# EAGLE design D1 - LCD TH Dupont (EAGLE 9.5.2)
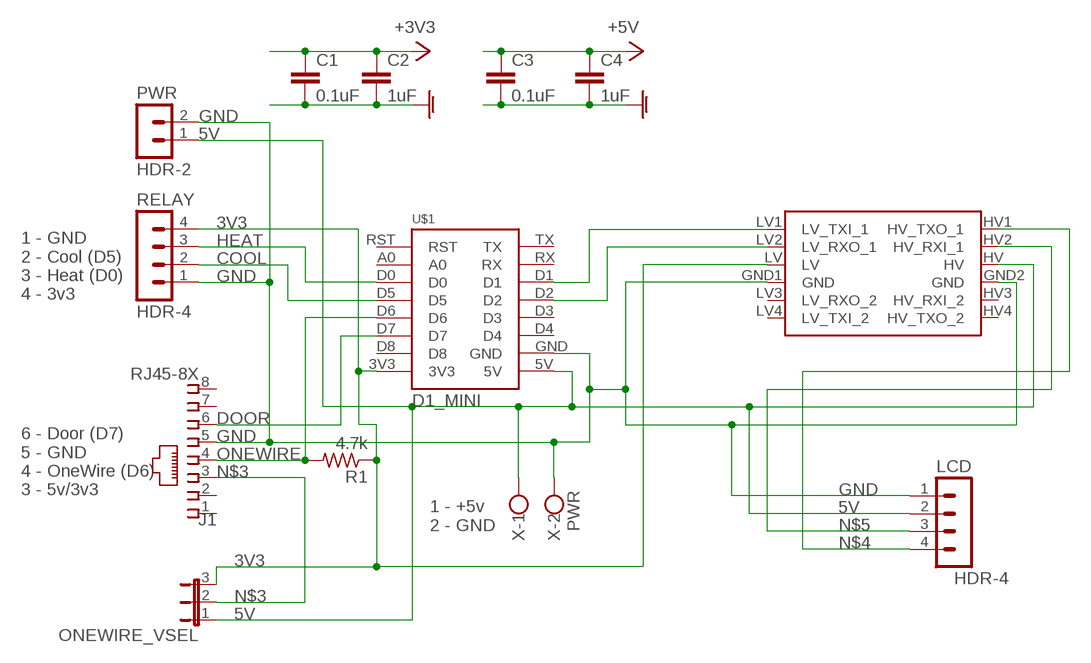
[diagram p0: schematic, sheet 1]

## Parts
C1  0.1uF  C-EU050-035X075  [C050-035X075]
C2  1uF  C-EU050-035X075  [C050-035X075]
C3  0.1uF  C-EU050-035X075  [C050-035X075]
C4  1uF  C-EU050-035X075  [C050-035X075]
J1  RJ45-8X  [RJ45-NS-XDIM]
LCD  HDR-4  [HDR-4_VERT]
ONEWIRE_VSEL  JP2ENOLABEL  [JP2-NOLABEL]
PWR  HDR-2  [HDR-2_VERT]
R1  4.7k  R-US_0309/12  [0309/12]
RELAY  HDR-4  [HDR-4_VERT]
U$1  D1_MINI  WEMOSCLEAN  [WEMOS-CLEAN]
U$3  SPARKFUN_LOGIC_LEVEL_CONVERTER  [SPARKFUN_LOGIC_LEVEL_CONVERTER]
X  PWR  W237-102  [W237-102]

## Nets
3V3 [3v]: C1.1 C2.1 ONEWIRE_VSEL.3 R1.1 RELAY.4 U$1.3V3 U$3.LV ; supply symbol labelled +3V3
5V [5v]: C3.1 C4.1 LCD.2 ONEWIRE_VSEL.1 PWR.1 U$1.5V U$3.HV X.1 ; supply symbol labelled +5V
COOL: RELAY.2 U$1.D5
DOOR: J1.6 U$1.D7
GND [Gnd]: C1.2 C2.2 C3.2 C4.2 J1.5 LCD.1 PWR.2 RELAY.1 U$1.GND U$3.GND1(GND) U$3.GND2(GND) X.2 ; supply symbol labelled GNDA
HEAT: RELAY.3 U$1.D0
N$1: U$1.D1 U$3.LV1(LV_TXI_1)
N$2: U$1.D2 U$3.LV2(LV_RXO_1)
N$3: J1.3 ONEWIRE_VSEL.2
N$4: LCD.4 U$3.HV1(HV_TXO_1)
N$5: LCD.3 U$3.HV2(HV_RXI_1)
ONEWIRE: J1.4 R1.2 U$1.D6
Unconnected: J1.1 J1.2 J1.7 J1.8 U$1.A0 U$1.D3 U$1.D4 U$1.D8 U$1.RST U$1.RX U$1.TX U$3.HV3(HV_RXI_2) U$3.HV4(HV_TXO_2) U$3.LV3(LV_RXO_2) U$3.LV4(LV_TXI_2)

## Notes on the sheet
- 1 - GND
  2 - Cool (D5)
  3 - Heat (D0)
  4 - 3v3
- 6 - Door (D7)
  5 - GND
  4 - OneWire (D6) 
  3 - 5v/3v3
- 1 - +5v
  2 - GND

## Library data of the parts
C1-C4 = rcl:C-EU: CAPACITOR, European symbol; SPICEPREFIX: C
J1 = Donnie:RJ45: CORCOM Modular RJ Jacks No Shield Source: www.tycoelectronics.com .. ENG_DS_1654001_1099_RJ_L_0507.pdf; MPN: RJ45-8X; OC_FARNELL: unknown; OC_NEWARK: 16R6101
LCD RELAY = Donnie:HDR-4: PIN HEADER
ONEWIRE_VSEL = Donnie:JP2E: JUMPER
PWR = Donnie:HDR-2
R1 = rcl:R-US_: RESISTOR, American symbol; SPICEPREFIX: R
U$1 = 1455413453956-wemos:WEMOS: LoLin D1 Mini controller socket
U$3 = SparkFun-Boards:SPARKFUN_LOGIC_LEVEL_CONVERTER: SparkFun Logic Level Converter -Bi-Directional This is the mechnical outline for the 3.3V - 5V bi directional logic level converter. *Note, the "LOCK" Package has the header pins staggered by an offset of 5 mils (off center line), so that when you slide a row of standard 0.1" headers into the PTH pads, it will hold position vertically. See the follwing turorial for more information on this type of special footprints: Sneaky Footprints <https://www.sparkfun.com/tutorials/114> SparkFun Products: SparkFun Logic Level Converter - Bi-Directional <https://www.sparkfun.com/products/12009>
X = con-wago-500:W237-102: WAGO SCREW CLAMP; MPN: 237-102; OC_FARNELL: unknown; OC_NEWARK: 70K9898

## Net classes
0 default: width 0.305 mm, clearance 0.305 mm
1 5v: width 0.406 mm, clearance 0.406 mm
2 3v: width 0.406 mm, clearance 0.406 mm
3 Gnd: width 0.406 mm, clearance 0.406 mm

## Board
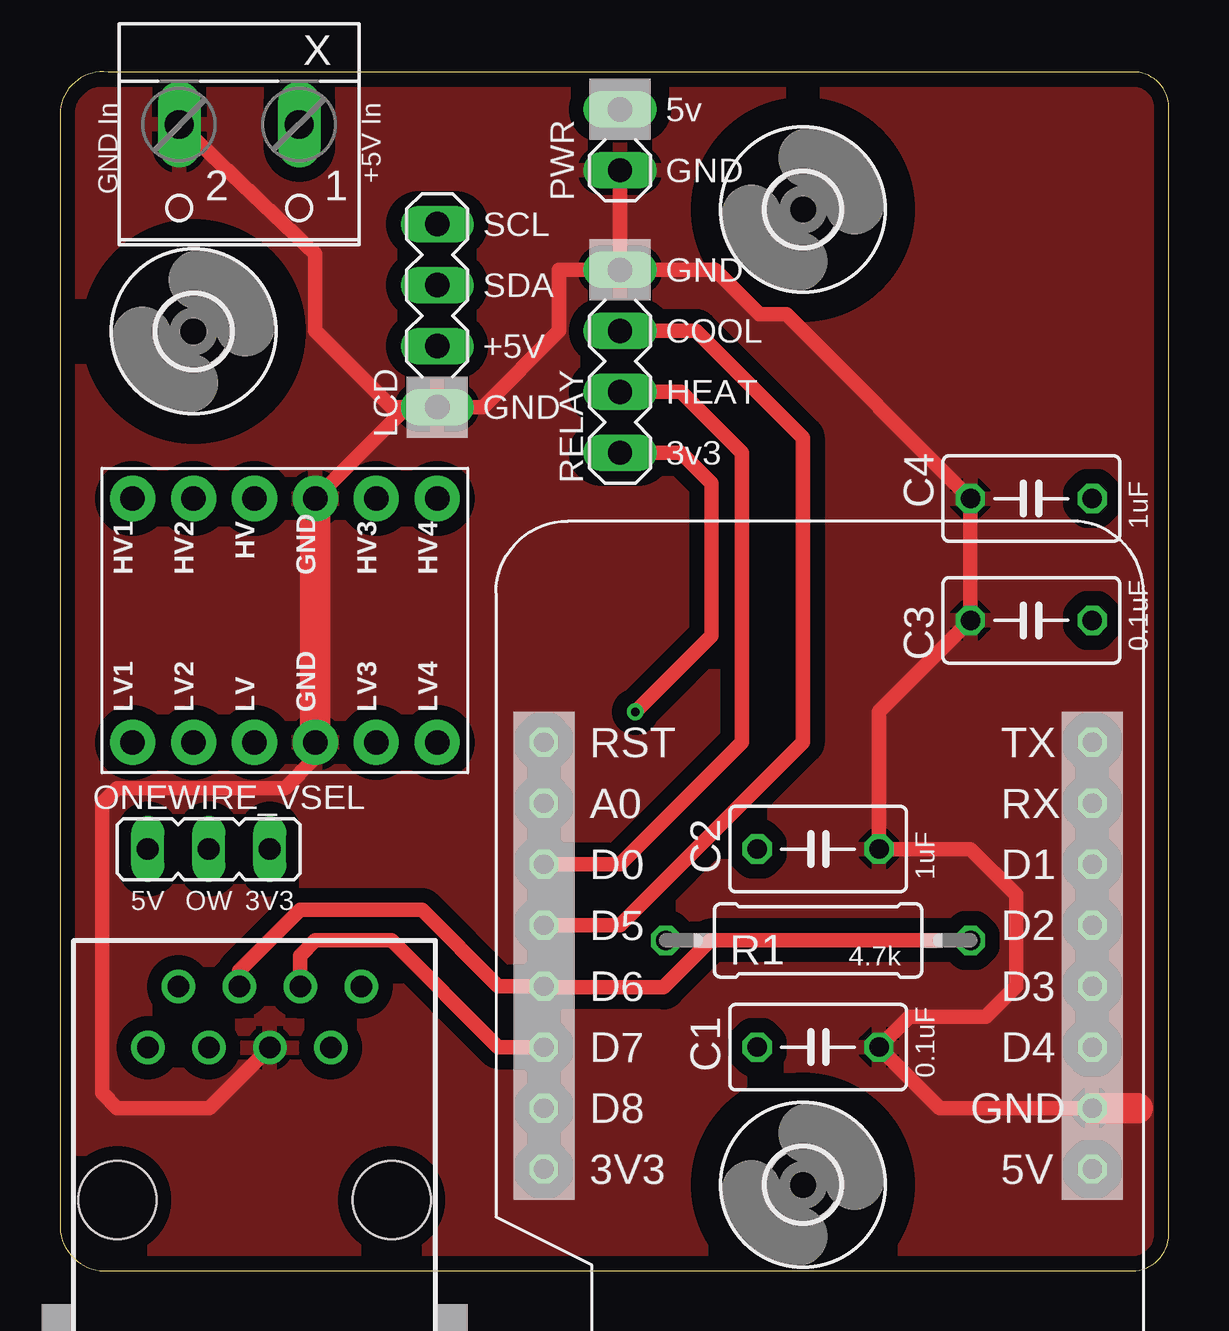
[diagram p1: board, top side]
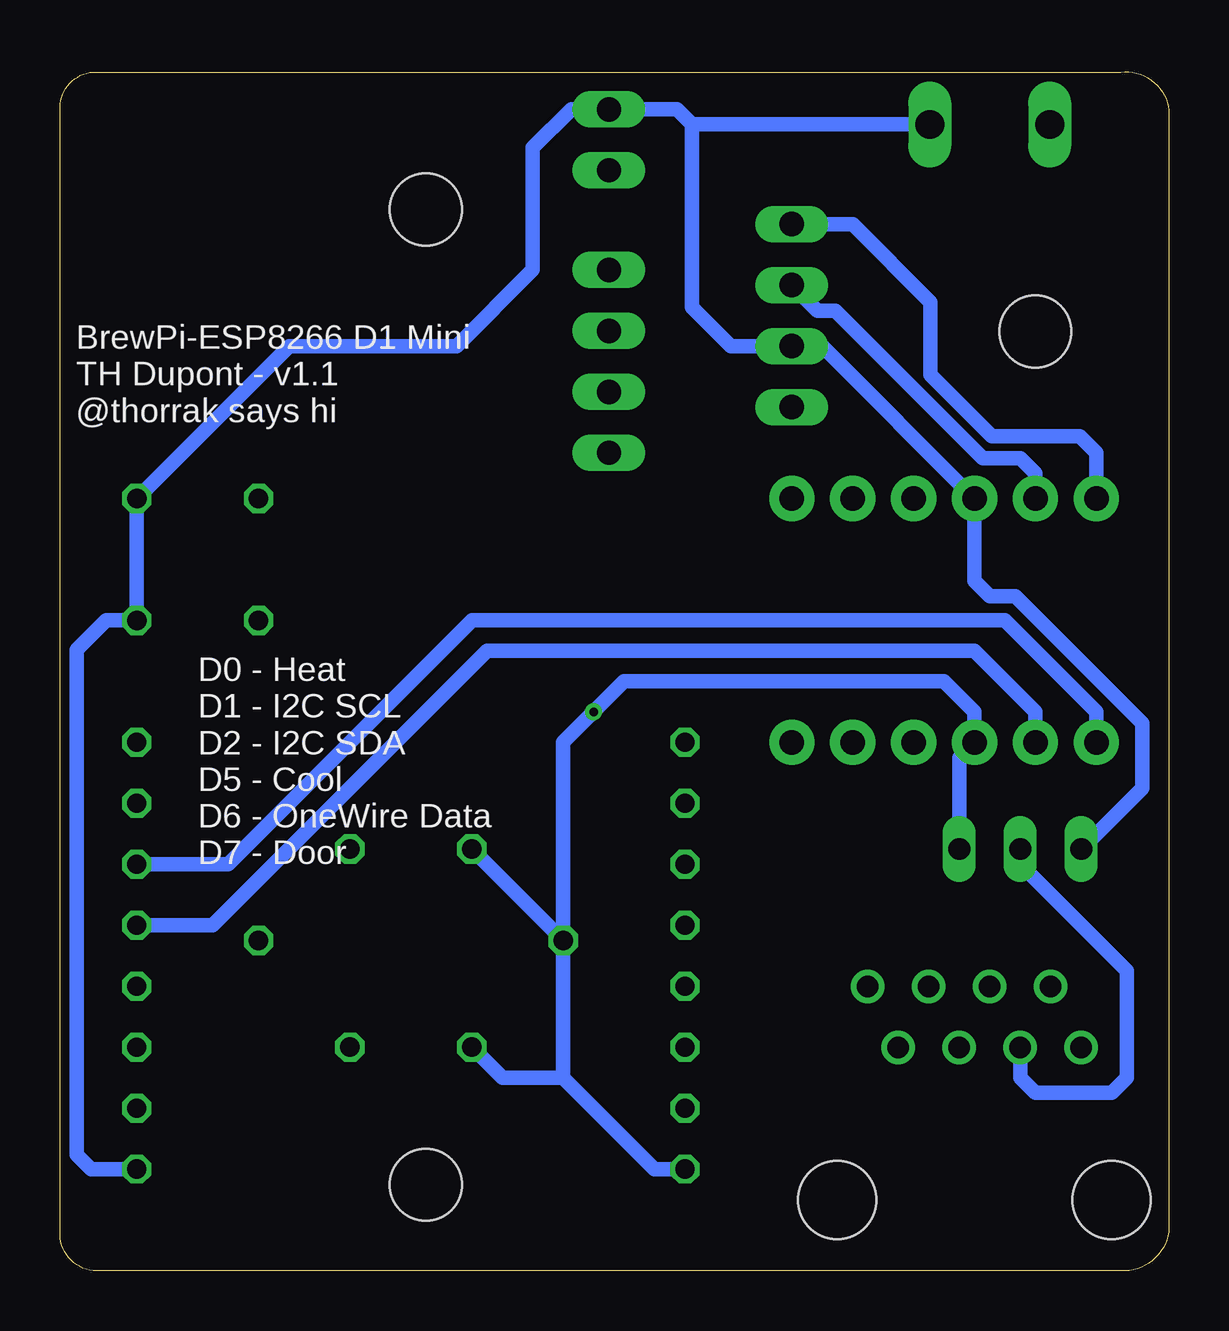
[diagram p2: board, bottom side, seen from below]

Size 46.23 x 49.97 mm. Coordinates in mm from the lower left corner, seen from the top.
Outline: 0,48.36 0,1.8 arc90 2,0 44.85,0 arc90 46.22,1.8 46.22,48.36 arc90 44.85,49.96 2,49.96 arc90 0,48.36
Copper layers (1*16): Top 0.0356mm / dielectric 1.5011mm / Bottom 0.0356mm
Design rules "PCBs_io": minimum track width 6mil, minimum drill 13mil, track to track 6mil, track to pad 6mil, pad to pad 6mil, via to via 6mil, smd to smd 6mil, copper to edge 15mil, drill to drill 6mil, minimum pad ring 7mil, minimum via ring 7mil, stop-mask expansion 3mil, vias tented up to drill 0mil, thermal gap 10mil

### Footprints (pad centres in the part's own frame; a part is rotated, then mirrored left to right if it is on the bottom)
C050-035X075 = drill 0.813 octagon: 1 -2.54,0; 2 2.54,0
RJ45-NS-XDIM = drill 0.9 pad 1.4: 1 -4.445,6.35; 2 -3.175,8.89; 3 -1.905,6.35; 4 -0.635,8.89; 5 0.635,6.35; 6 1.905,8.89; 7 3.175,6.35; 8 4.445,8.89 | hole 3.251: -5.715,0; 5.715,0
HDR-4_VERT = drill 1.016 long: 1 0,0; 2 2.54,0; 3 5.08,0; 4 7.62,0
JP2-NOLABEL = drill 0.914 long: 1 -2.54,0; 2 0,0; 3 2.54,0
HDR-2_VERT = drill 1.016 long: 1 0,0; 2 2.54,0
0309/12 = drill 0.813 octagon: 1 -6.35,0; 2 6.35,0
WEMOS-CLEAN = drill 0.8 octagon: 3V3 0,0; 5V 22.86,0; A0 0,15.24; D0 0,12.7; D1 22.86,12.7; D2 22.86,10.16; D3 22.86,7.62; D4 22.86,5.08; D5 0,10.16; D6 0,7.62; D7 0,5.08; D8 0,2.54; GND 22.86,2.54; RST 0,17.78; RX 22.86,15.24; TX 22.86,17.78
3,0 = hole 3: 0,0
SPARKFUN_LOGIC_LEVEL_CONVERTER = drill 1.016 pad 1.88: GND1 -5.08,-1.27; GND2 5.08,-1.27; HV 5.08,1.27; HV1 5.08,6.35; HV2 5.08,3.81; HV3 5.08,-3.81; HV4 5.08,-6.35; LV -5.08,1.27; LV1 -5.08,6.35; LV2 -5.08,3.81; LV3 -5.08,-3.81; LV4 -5.08,-6.35
W237-102 = drill 1.194 long: 1 -2.5,-1.27; 2 2.5,-1.27

### Placement (x,y rotation side)
C1  31.6,9.33 0 top
C2  31.6,17.58 0 top
C3  40.49,27.11 180 top
C4  40.49,32.19 180 top
J1  8.11,2.96 0 top
LCD  15.72,36 90 top
ONEWIRE_VSEL  6.2,17.58 0 top
PWR  23.35,48.4 270 top
R1  31.6,13.77 0 top
RELAY  23.35,41.71 270 top
U$1  20.17,4.25 0 top
U$2  [3,0]  5.57,39.15 0 top
U$3  9.38,27.11 90 top
U$4  [3,0]  30.97,3.59 0 top
U$5  [3,0]  30.97,44.23 0 top
X  7.47,46.5 180 top

### Tracks (layer width: path | path; a pad name or v marks a point on that pad's centre or on a via)
3V3  (via drill 0.35)
  Top 0.61: v23.98,23.3 27.16,26.47 27.16,32.82 25.89,34.09 RELAY.4
  Bottom 0.61: U$1.3V3 21.44,4.25 25.25,8.06 | 25.25,8.06 R1.1 | R1.1 25.25,22.03 v23.98,23.3 22.71,24.57 9.38,24.57 8.11,23.3 U$3.LV 8.74,21.39 ONEWIRE_VSEL.3 | C1.1 27.79,8.06 25.25,8.06 | C2.1 R1.1
5V
  Bottom 0.61: U$1.5V 44.94,4.25 45.53,4.84 45.53,25.88 44.3,27.11 C3.1 C4.1 36.68,38.54 29.7,38.54 26.52,41.71 26.52,46.79 24.91,48.4 PWR.1 20.51,48.4 19.88,47.77 | ONEWIRE_VSEL.1 1.12,20.12 1.12,22.83 6.41,28.12 7.47,28.12 8.11,28.76 U$3.HV 14.46,38.54 LCD.2 18.27,38.54 19.88,40.15 19.88,47.77 | X.1 19.88,47.77
COOL
  Top 0.61: U$1.D5 23.35,14.41 30.96,22.03 30.96,34.73 26.52,39.17 RELAY.2
DOOR
  Top 0.61: J1.6 10.01,13.14 10.64,13.77 13.82,13.77 18.27,9.33 U$1.D7
GND
  Top 0.61: U$3.GND2 14.46,36 | 14.46,36 LCD.1 17.63,36 20.8,39.17 20.8,41.71 RELAY.1 | X.2 10.64,42.39 10.64,39.17 13.82,36 14.46,36 | RELAY.1 27.31,41.71 29.16,39.86 30.27,39.86 C4.2 C3.2 34.14,23.3 C2.2 37.95,17.58 39.86,15.68 39.86,11.87 38.59,10.6 35.41,10.6 C1.2 36.68,6.79 U$1.GND | PWR.2 RELAY.1 | J1.5 6.22,6.79 2.39,6.79 1.76,7.42 1.76,19.49 2.39,20.12 9.38,20.12 10.64,21.39 U$3.GND1
  Top 1.27: U$3.GND2 U$3.GND1 | U$1.GND 44.94,6.79
  pour Top (isolate 0.61): 0.1,49.97 46.2,49.97 46.2,-0.2 0.1,-0.2
HEAT
  Top 0.61: U$1.D0 23.35,16.95 28.43,22.03 28.43,34.09 25.89,36.63 RELAY.3
N$1
  Bottom 0.61: U$1.D1 39.22,16.95 29.06,27.11 6.83,27.11 3.02,23.3 U$3.LV1
N$2
  Bottom 0.61: U$1.D2 39.86,14.41 28.43,25.84 8.11,25.84 5.56,23.3 U$3.LV2
N$3
  Bottom 0.61: ONEWIRE_VSEL.2 6.2,16.95 4.61,15.36 4.29,15.04 1.76,12.5 1.76,8.06 2.39,7.42 5.56,7.42 6.21,8.06 J1.3
N$4
  Bottom 0.61: U$3.HV1 3.02,34.09 3.72,34.78 7.38,34.78 9.94,37.34 9.94,40.37 13.19,43.62 LCD.4
N$5
  Bottom 0.61: LCD.3 14.66,40.01 13.9,40.01 7.76,33.87 6.2,33.87 5.56,33.23 U$3.HV2
ONEWIRE
  Top 0.61: J1.4 7.47,12.5 10.01,15.04 15.09,15.04 18.27,11.87 U$1.D6 20.22,11.82 25.16,11.82 27.12,13.77 R1.2

### Text on the board
tPlace: GND In | +5V In | SCL | GND | SDA | +5V | COOL | HEAT | GND | 3v3
tNames: 5v | GND | 1uF | 0.1uF | 1uF | 5V | OW | 3V3 | 4.7k | 0.1uF
bNames: BrewPi-ESP8266 D1 Mini / TH Dupont - v1.1 / @thorrak says hi | D0 - Heat / D1 - I2C SCL / D2 - I2C SDA / D5 - Cool / D6 - OneWire Data / D7 - Door